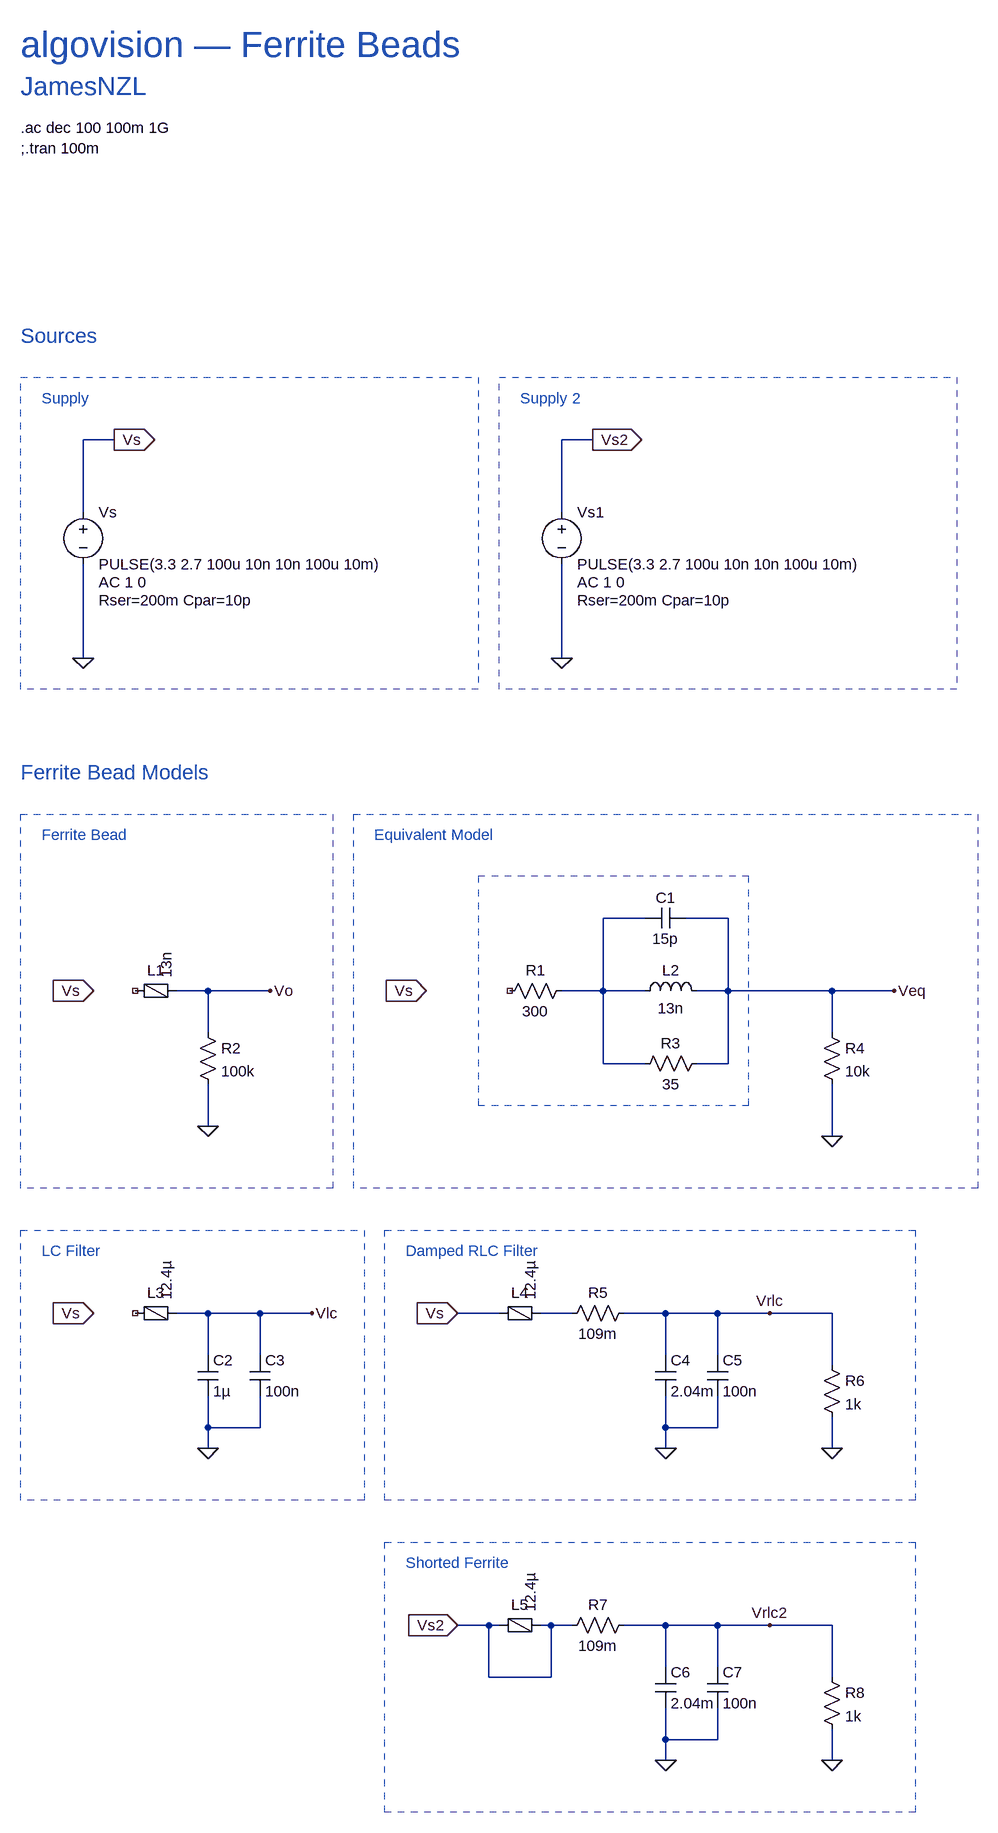
[diagram p0: schematic ferrites.asc]
ferrites.asc, the LTspice schematic file:
Version 4
SHEET 1 1264 1476
WIRE -1104 -640 -1152 -640
WIRE -368 -640 -416 -640
WIRE -1152 -528 -1152 -640
WIRE -416 -528 -416 -640
WIRE -1152 -304 -1152 -448
WIRE -416 -304 -416 -448
WIRE -288 96 -352 96
WIRE -160 96 -224 96
WIRE -960 208 -1008 208
WIRE -864 208 -960 208
WIRE -352 208 -352 96
WIRE -352 208 -416 208
WIRE -288 208 -352 208
WIRE -160 208 -160 96
WIRE -160 208 -208 208
WIRE 0 208 -160 208
WIRE 96 208 0 208
WIRE -960 272 -960 208
WIRE 0 272 0 208
WIRE -352 320 -352 208
WIRE -288 320 -352 320
WIRE -160 320 -160 208
WIRE -160 320 -208 320
WIRE -960 416 -960 352
WIRE 0 432 0 352
WIRE -960 704 -1008 704
WIRE -880 704 -960 704
WIRE -800 704 -880 704
WIRE -512 704 -576 704
WIRE -400 704 -448 704
WIRE -256 704 -320 704
WIRE -176 704 -256 704
WIRE -96 704 -176 704
WIRE 0 704 -96 704
WIRE -960 768 -960 704
WIRE -880 768 -880 704
WIRE -256 768 -256 704
WIRE -176 768 -176 704
WIRE 0 784 0 704
WIRE -960 880 -960 832
WIRE -880 880 -880 832
WIRE -880 880 -960 880
WIRE -256 880 -256 832
WIRE -176 880 -176 832
WIRE -176 880 -256 880
WIRE -960 912 -960 880
WIRE -256 912 -256 880
WIRE 0 912 0 864
WIRE -528 1184 -576 1184
WIRE -512 1184 -528 1184
WIRE -432 1184 -448 1184
WIRE -400 1184 -432 1184
WIRE -256 1184 -320 1184
WIRE -176 1184 -256 1184
WIRE -96 1184 -176 1184
WIRE 0 1184 -96 1184
WIRE -256 1248 -256 1184
WIRE -176 1248 -176 1184
WIRE -528 1264 -528 1184
WIRE -432 1264 -432 1184
WIRE -432 1264 -528 1264
WIRE 0 1264 0 1184
WIRE -256 1360 -256 1312
WIRE -176 1360 -176 1312
WIRE -176 1360 -256 1360
WIRE -256 1392 -256 1360
WIRE 0 1392 0 1344
FLAG -1136 208 Vs
IOPIN -1136 208 In
FLAG -1104 -640 Vs
IOPIN -1104 -640 Out
FLAG -1152 -304 0
FLAG -864 208 Vo
FLAG -624 208 Vs
IOPIN -624 208 In
FLAG 96 208 Veq
FLAG -960 416 0
FLAG 0 432 0
FLAG -1136 704 Vs
IOPIN -1136 704 In
FLAG -800 704 Vlc
FLAG -960 912 0
FLAG -576 704 Vs
IOPIN -576 704 In
FLAG -96 704 Vrlc
FLAG -256 912 0
FLAG 0 912 0
FLAG -576 1184 Vs2
IOPIN -576 1184 In
FLAG -96 1184 Vrlc2
FLAG -256 1392 0
FLAG 0 1392 0
FLAG -368 -640 Vs2
IOPIN -368 -640 Out
FLAG -416 -304 0
SYMBOL voltage -1152 -544 R0
WINDOW 123 24 123 Left 2
WINDOW 39 24 151 Left 2
SYMATTR Value2 AC 1 0
SYMATTR SpiceLine Rser=200m Cpar=10p
SYMATTR InstName Vs
SYMATTR Value PULSE(3.3 2.7 100u 10n 10n 100u 10m)
SYMBOL FerriteBead -1040 208 R270
WINDOW 0 16 0 VTop 2
SYMATTR InstName L1
SYMATTR Value 13n
SYMATTR SpiceLine Ipk=10.5 Rser=3 Rpar=35 Cpar=15p
SYMBOL res -400 192 R90
WINDOW 0 0 56 VBottom 2
WINDOW 3 32 56 VTop 2
SYMATTR InstName R1
SYMATTR Value 300
SYMBOL cap -224 80 R90
WINDOW 0 0 32 VBottom 2
WINDOW 3 32 32 VTop 2
SYMATTR InstName C1
SYMATTR Value 15p
SYMBOL res -192 304 R90
WINDOW 0 0 56 VBottom 2
WINDOW 3 32 56 VTop 2
SYMATTR InstName R3
SYMATTR Value 35
SYMBOL ind -304 224 R270
WINDOW 0 32 56 VTop 2
WINDOW 3 5 56 VBottom 2
SYMATTR InstName L2
SYMATTR Value 13n
SYMBOL res -976 256 R0
SYMATTR InstName R2
SYMATTR Value 100k
SYMBOL res -16 256 R0
SYMATTR InstName R4
SYMATTR Value 10k
SYMBOL FerriteBead -1040 704 R270
WINDOW 0 16 0 VTop 2
SYMATTR InstName L3
SYMATTR Value 12.4µ
SYMATTR SpiceLine Ipk=4.5 Rser=0.0175 Rpar=12800 Cpar=8.5p mfg="Würth Elektronik" pn="7427929115 WE-PF 1280"
SYMBOL cap -976 768 R0
SYMATTR InstName C2
SYMATTR Value 1µ
SYMBOL cap -896 768 R0
SYMATTR InstName C3
SYMATTR Value 100n
SYMBOL cap -272 768 R0
SYMATTR InstName C4
SYMATTR Value 2.04m
SYMBOL cap -192 768 R0
SYMATTR InstName C5
SYMATTR Value 100n
SYMBOL res -304 688 R90
WINDOW 0 0 56 VBottom 2
WINDOW 3 32 56 VTop 2
SYMATTR InstName R5
SYMATTR Value 109m
SYMBOL res -16 768 R0
SYMATTR InstName R6
SYMATTR Value 1k
SYMBOL FerriteBead -480 704 R270
WINDOW 0 16 0 VTop 2
SYMATTR InstName L4
SYMATTR Value 12.4µ
SYMATTR SpiceLine Ipk=4.5 Rser=0.0175 Rpar=12800 Cpar=8.5p mfg="Würth Elektronik" pn="7427929115 WE-PF 1280"
SYMBOL cap -272 1248 R0
SYMATTR InstName C6
SYMATTR Value 2.04m
SYMBOL cap -192 1248 R0
SYMATTR InstName C7
SYMATTR Value 100n
SYMBOL res -304 1168 R90
WINDOW 0 0 56 VBottom 2
WINDOW 3 32 56 VTop 2
SYMATTR InstName R7
SYMATTR Value 109m
SYMBOL res -16 1248 R0
SYMATTR InstName R8
SYMATTR Value 1k
SYMBOL FerriteBead -480 1184 R270
WINDOW 0 16 0 VTop 2
SYMATTR InstName L5
SYMATTR Value 12.4µ
SYMATTR SpiceLine Ipk=4.5 Rser=0.0175 Rpar=12800 Cpar=8.5p mfg="Würth Elektronik" pn="7427929115 WE-PF 1280"
SYMBOL voltage -416 -544 R0
WINDOW 123 24 123 Left 2
WINDOW 39 24 151 Left 2
SYMATTR Value2 AC 1 0
SYMATTR SpiceLine Rser=200m Cpar=10p
SYMATTR InstName Vs1
SYMATTR Value PULSE(3.3 2.7 100u 10n 10n 100u 10m)
TEXT -1248 -1120 Left 2 !.ac dec 100 100m 1G
TEXT -1248 -1248 Left 5 ;algovision — Ferrite Beads
TEXT -1248 -1184 Left 4 ;JamesNZL
TEXT -1248 -800 Left 3 ;Sources
TEXT -1248 -128 Left 3 ;Ferrite Bead Models
TEXT -1216 -32 Left 2 ;Ferrite Bead
TEXT -1216 -704 Left 2 ;Supply
TEXT -704 -32 Left 2 ;Equivalent Model
TEXT -1216 608 Left 2 ;LC Filter
TEXT -1248 -1088 Left 2 !;.tran 100m
TEXT -656 608 Left 2 ;Damped RLC Filter
TEXT -656 1088 Left 2 ;Shorted Ferrite
TEXT -480 -704 Left 2 ;Supply 2
RECTANGLE Normal -768 512 -1248 -64 2
RECTANGLE Normal -544 -256 -1248 -736 2
RECTANGLE Normal 224 512 -736 -64 2
RECTANGLE Normal -544 384 -128 32 2
RECTANGLE Normal -720 992 -1248 576 2
RECTANGLE Normal 128 992 -688 576 2
RECTANGLE Normal 128 1472 -688 1056 2
RECTANGLE Normal 192 -256 -512 -736 2

The netlist it stands for:
* ferrites.asc
Vs Vs 0 PULSE(3.3 2.7 100u 10n 10n 100u 10m) AC 1 0 Rser=200m Cpar=10p
L1 NC_01 Vo 13n Ipk=10.5 Rser=3 Rpar=35 Cpar=15p
R1 N001 NC_02 300
C1 Veq N001 15p
R3 Veq N001 35
L2 N001 Veq 13n
R2 Vo 0 100k
R4 Veq 0 10k
L3 NC_03 Vlc 12.4µ Ipk=4.5 Rser=0.0175 Rpar=12800 Cpar=8.5p mfg="Würth Elektronik" pn="7427929115 WE-PF 1280"
C2 Vlc 0 1µ
C3 Vlc 0 100n
C4 Vrlc 0 2.04m
C5 Vrlc 0 100n
R5 Vrlc N002 109m
R6 Vrlc 0 1k
L4 Vs N002 12.4µ Ipk=4.5 Rser=0.0175 Rpar=12800 Cpar=8.5p mfg="Würth Elektronik" pn="7427929115 WE-PF 1280"
C6 Vrlc2 0 2.04m
C7 Vrlc2 0 100n
R7 Vrlc2 Vs2 109m
R8 Vrlc2 0 1k
L5 Vs2 Vs2 12.4µ Ipk=4.5 Rser=0.0175 Rpar=12800 Cpar=8.5p mfg="Würth Elektronik" pn="7427929115 WE-PF 1280"
Vs1 Vs2 0 PULSE(3.3 2.7 100u 10n 10n 100u 10m) AC 1 0 Rser=200m Cpar=10p
.ac dec 100 100m 1G
* algovision — Ferrite Beads
* JamesNZL
* Sources
* Ferrite Bead Models
* Ferrite Bead
* Supply
* Equivalent Model
* LC Filter
;.tran 100m
* Damped RLC Filter
* Shorted Ferrite
* Supply 2
.backanno
.end